# Altium schematic sheet 01_REVISION_HISTORY.SchDoc: =TitleParameter
size A3; Organization: ASISGUARD; Address1: Kemalpasa, Kemalpasa Cd. No:290 D:292H, 35060 Bornova/Izmir/Turkey
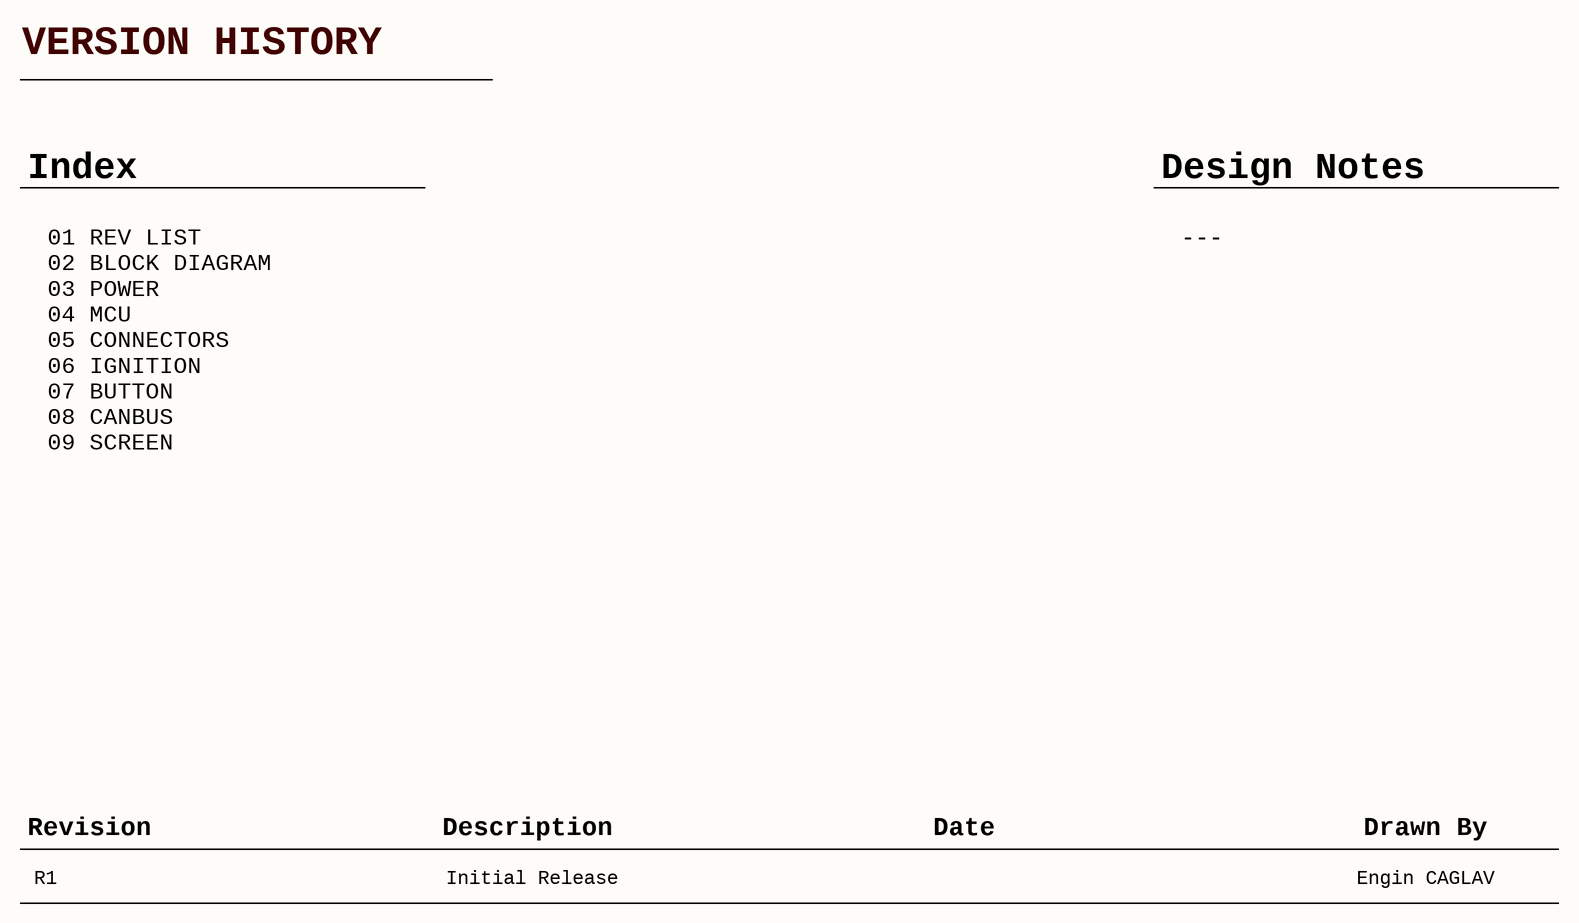
[diagram p0: 01_REVISION_HISTORY.SchDoc]

## Notes on the sheet
- VERSION HISTORY
- Index
- Design Notes
- 01 REV LIST
  02 BLOCK DIAGRAM
  03 POWER
  04 MCU
  05 CONNECTORS
  06 IGNITION
  07 BUTTON
  08 CANBUS
  09 SCREEN
- ---
- Revision
- Description
- Date
- Drawn By
- R1
- Initial Release
- Engin CAGLAV
- Proje/Project:
- Sayfa Adı/Document Name:
- Çizilme Tarihi/Drawing Date
- E. CAGLAV
- Tasarlayan/Designed By
- Sayfa/Sheet:
- Revision:
- of
- Son Güncelleme/Last Edit Date
- Kontrol eden/Checked By
- Onaylayan/Approved By
- Boyut/Size:
- Varyant/Variant:
- Dil/Language:
- A3
- ENG